# EAGLE design TSOC_NEOLED (EAGLE 6.6.0)
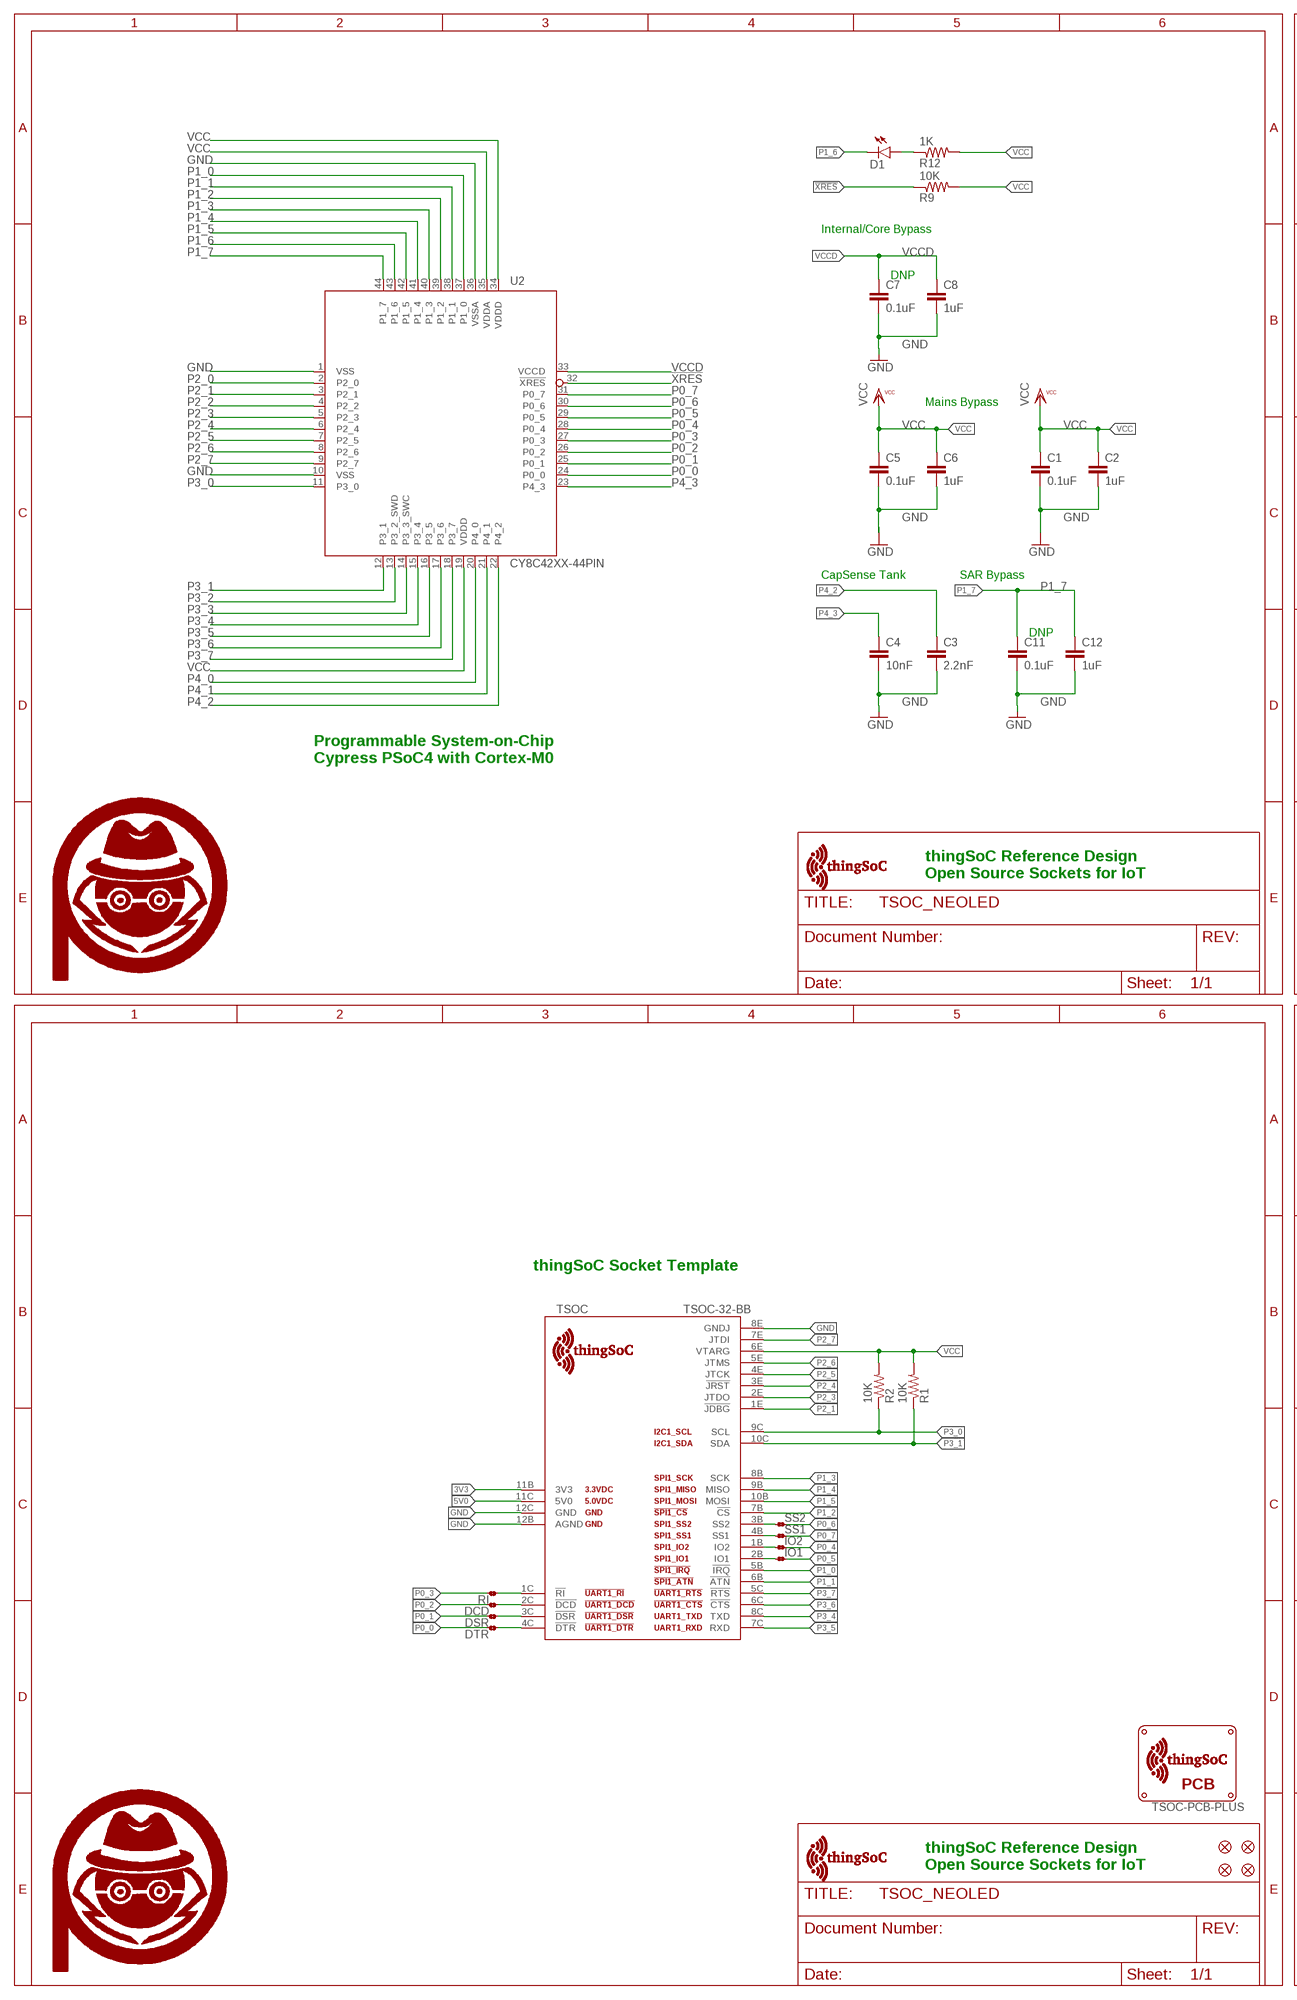
[diagram p0: schematic, sheet 1, part 1 of 2]
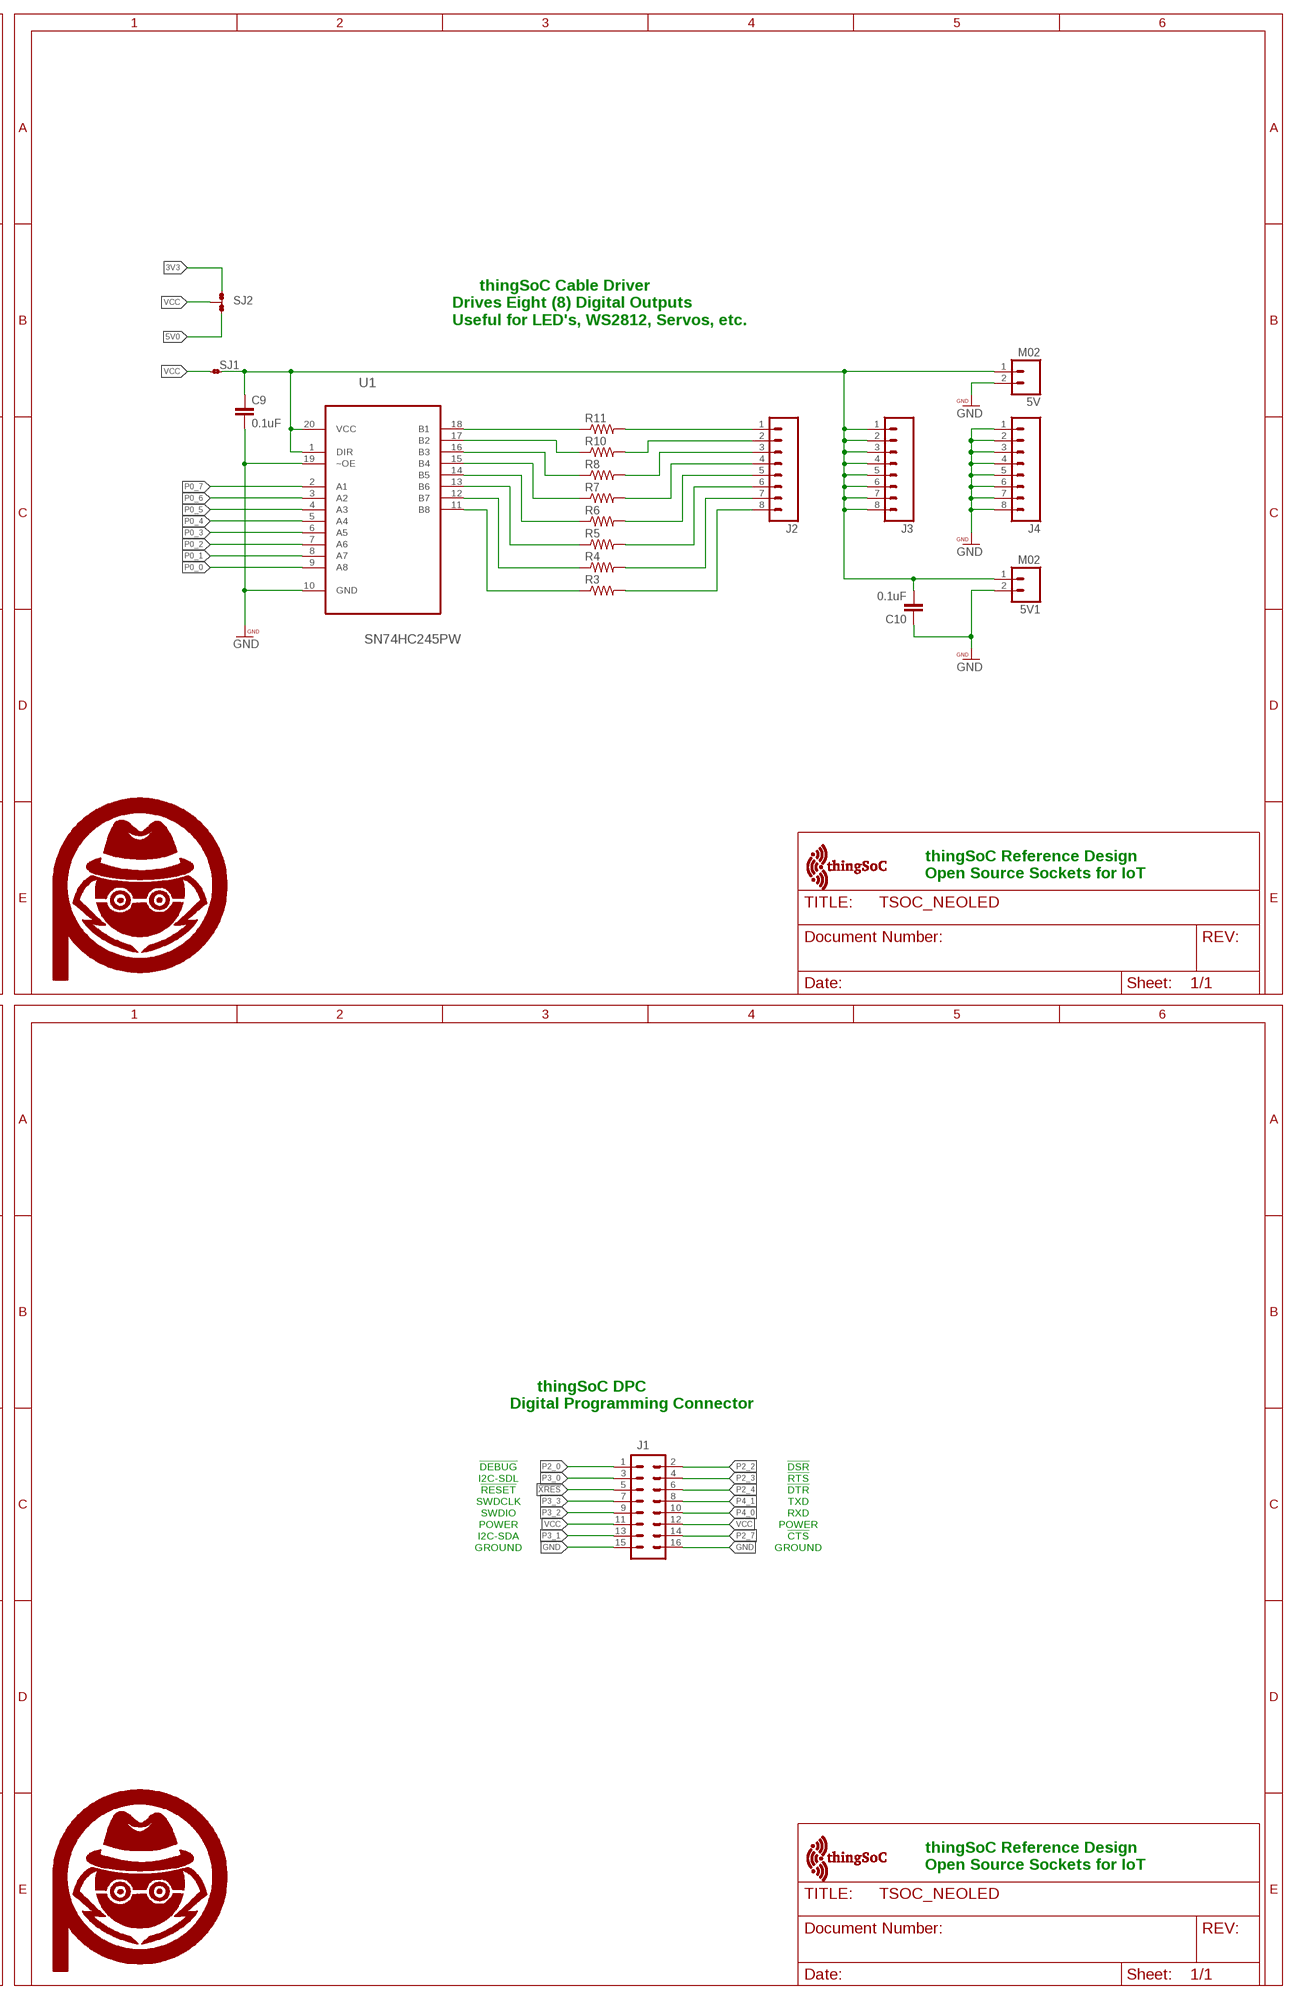
[diagram p1: schematic, sheet 1, part 2 of 2]

## Parts
5V  M02  [1X02]
5V1  M02  [1X02]
$$U$1  TSOC-LOGO-SMALL  [TSOC-LOGO-SML]
$$U$2  TSOC-LOGO-MED  [TSOC-LOGO-MED]
C1  0.1uF  CAP0603-CAP  [0603-CAP]
C2  1uF  CAP0603-CAP  [0603-CAP]
C3  2.2nF  CAP0603-CAP  [0603-CAP]
C4  10nF  CAP0603-CAP  [0603-CAP]
C5  0.1uF  CAP0603-CAP  [0603-CAP]
C6  1uF  CAP0603-CAP  [0603-CAP]
C7  0.1uF  CAP0603-CAP  [0603-CAP]
C8  1uF  CAP0603-CAP  [0603-CAP]
C9  0.1uF  CAP0603-CAP  [0603-CAP]
C10  0.1uF  CAP0603-CAP  [0603-CAP]
C11  0.1uF  CAP0603-CAP  [0603-CAP]
C12  1uF  CAP0603-CAP  [0603-CAP]
D1  LED0603  [LED-0603]
DCD  JMP-2-NO  [JMP-2-NO]
DSR  JMP-2-NO  [JMP-2-NO]
DTR  JMP-2-NO  [JMP-2-NO]
FID1  FIDUCIALUFIDUCIAL  [MICRO-FIDUCIAL]
FID2  FIDUCIALUFIDUCIAL  [MICRO-FIDUCIAL]
FID3  FIDUCIALUFIDUCIAL  [MICRO-FIDUCIAL]
FID4  FIDUCIALUFIDUCIAL  [MICRO-FIDUCIAL]
IO1  JMP-2-NO  [JMP-2-NO]
IO2  JMP-2-NO  [JMP-2-NO]
J1  M08X2  [2X8]
J2  M08  [1X08_ROUND]
J3  M08  [1X08_ROUND]
J4  M08  [1X08_ROUND]
R1  10K  RESISTOR_SFE0603-RES  [0603-RES]
R2  10K  RESISTOR_SFE0603-RES  [0603-RES]
R3  RESISTOR0603-RES  [0603-RES]
R4  RESISTOR0603-RES  [0603-RES]
R5  RESISTOR0603-RES  [0603-RES]
R6  RESISTOR0603-RES  [0603-RES]
R7  RESISTOR0603-RES  [0603-RES]
R8  RESISTOR0603-RES  [0603-RES]
R9  10K  RESISTOR_SFE0603-RES  [0603-RES]
R10  RESISTOR0603-RES  [0603-RES]
R11  RESISTOR0603-RES  [0603-RES]
R12  1K  RESISTOR_SFE0603-RES  [0603-RES]
RI  JMP-2-NO  [JMP-2-NO]
SJ1  JMP-2-NC  [JMP-2-NC]
SJ2  JMP-3-NC  [JMP-3-NC]
SS1  JMP-2-NO  [JMP-2-NO]
SS2  JMP-2-NO  [JMP-2-NO]
TSOC  TSOC-32-BB  [TSOC-BB-S32]
U1  SN74HC245PW  [SOP65P640X120-20N]
U2  CY8C42XX-44PIN  [TQFP-10X10-44]
U$1  TSOC-PCB-PLUS  [TSOC-BB-BRD-PLUS]
U$3  PA_LOGO_SYMNULL  [NULL_SYM]
U$9  PA_LOGO_SYMNULL  [NULL_SYM]
U$10  PA_LOGO_SYMNULL  [NULL_SYM]
U$11  PA_LOGO_SYMNULL  [NULL_SYM]
U$100  TSOC-LOGO-SMALL  [TSOC-LOGO-SML]
U$101  TSOC-LOGO-LRG  [TSOC-LOGO-LRG]

## Nets
3V3: SJ2.1 TSOC.11B(3V3)
5V0: SJ2.3 TSOC.11C(5V0)
!DCD: DCD.1 TSOC.2C(!DCD)
!DSR: DSR.1 TSOC.3C(!DSR)
!DTR: DTR.1 TSOC.4C(!DTR)
!R!: RI.1 TSOC.1C(!RI)
!XRES: J1.5 R9.1 U2.32(!XRES)
GND: 5V1.2 5V.2 C1.2 C2.2 C3.2 C4.2 C5.2 C6.2 C7.2 C8.2 C9.2 C10.1 C11.2 C12.2 J1.15 J1.16 J4.1 J4.2 J4.3 J4.4 J4.5 J4.6 J4.7 J4.8 TSOC.8E(GNDJ) TSOC.12B(AGND) TSOC.12C(GND) U1.10(GND) U1.19(~OE) U2.1(VSS) U2.10(VSS) U2.36(VSSA)
IO1: IO1.1 TSOC.2B(IO1)
IO2: IO2.1 TSOC.1B(IO2)
N$1: J2.1 R11.2
N$2: J2.2 R10.2
N$3: J2.3 R8.2
N$4: J2.4 R7.2
N$5: J2.5 R6.2
N$6: J2.6 R5.2
N$7: J2.7 R4.2
N$8: J2.8 R3.2
N$9: R11.1 U1.18(B1)
N$10: R10.1 U1.17(B2)
N$11: R8.1 U1.16(B3)
N$12: R7.1 U1.15(B4)
N$13: R6.1 U1.14(B5)
N$14: R5.1 U1.13(B6)
N$15: R4.1 U1.12(B7)
N$16: R3.1 U1.11(B8)
N$17: D1.A R12.1
P0_0: DTR.2 U1.9(A8) U2.24(P0_0)
P0_1: DSR.2 U1.8(A7) U2.25(P0_1)
P0_2: DCD.2 U1.7(A6) U2.26(P0_2)
P0_3: RI.2 U1.6(A5) U2.27(P0_3)
P0_4: IO2.2 U1.5(A4) U2.28(P0_4)
P0_5: IO1.2 U1.4(A3) U2.29(P0_5)
P0_6: SS2.2 U1.3(A2) U2.30(P0_6)
P0_7: SS1.2 U1.2(A1) U2.31(P0_7)
P1_0: TSOC.5B(!IRQ) U2.37(P1_0)
P1_1: TSOC.6B(!ATN) U2.38(P1_1)
P1_2: TSOC.7B(!CS) U2.39(P1_2)
P1_3: TSOC.8B(SCK) U2.40(P1_3)
P1_4: TSOC.9B(MISO) U2.41(P1_4)
P1_5: TSOC.10B(MOSI) U2.42(P1_5)
P1_6: D1.C U2.43(P1_6)
P1_7: C11.1 C12.1 U2.44(P1_7)
P2_0: J1.1 U2.2(P2_0)
P2_1: TSOC.1E(!JDBG) U2.3(P2_1)
P2_2: J1.2 U2.4(P2_2)
P2_3: J1.4 TSOC.2E(JTDO) U2.5(P2_3)
P2_4: J1.6 TSOC.3E(!JRST) U2.6(P2_4)
P2_5: TSOC.4E(JTCK) U2.7(P2_5)
P2_6: TSOC.5E(JTMS) U2.8(P2_6)
P2_7: J1.14 TSOC.7E(JTDI) U2.9(P2_7)
P3_0: J1.3 R2.1 TSOC.9C(SCL) U2.11(P3_0)
P3_1: J1.13 R1.1 TSOC.10C(SDA) U2.12(P3_1)
P3_2: J1.9 U2.13(P3_2_SWD)
P3_3: J1.7 U2.14(P3_3_SWC)
P3_4: TSOC.8C(TXD) U2.15(P3_4)
P3_5: TSOC.7C(RXD) U2.16(P3_5)
P3_6: TSOC.6C(!CTS) U2.17(P3_6)
P3_7: TSOC.5C(!RTS) U2.18(P3_7)
P4_0: J1.10 U2.20(P4_0)
P4_1: J1.8 U2.21(P4_1)
P4_2: C3.1 U2.22(P4_2)
P4_3: C4.1 U2.23(P4_3)
SS1: SS1.1 TSOC.4B(SS1)
SS2: SS2.1 TSOC.3B(SS2)
VCC: C1.1 C2.1 C5.1 C6.1 J1.11 J1.12 R1.2 R2.2 R9.2 R12.2 SJ1.1 SJ2.2 TSOC.6E(VTARG) U2.19(VDDD) U2.34(VDDD) U2.35(VDDA)
VCCD: C7.1 C8.1 U2.33(VCCD)
VEXT: 5V1.1 5V.1 C9.1 C10.2 J3.1 J3.2 J3.3 J3.4 J3.5 J3.6 J3.7 J3.8 SJ1.2 U1.1(DIR) U1.20(VCC)

## Notes on the sheet
- Internal/Core Bypass
- DNP
- thingSoC Cable Driver
  Drives Eight (8) Digital Outputs
  Useful for LED's, WS2812, Servos, etc.
- Mains Bypass
- CapSense Tank | SAR Bypass
- DNP
- Programmable System-on-Chip
  Cypress PSoC4 with Cortex-M0
- thingSoC Reference Design
  Open Source Sockets for IoT
- thingSoC Reference Design
  Open Source Sockets for IoT
- thingSoC Socket Template
- thingSoC DPC
  Digital Programming Connector
- !DEBUG | !DSR
- I2C-SDL | !RTS
- !RESET | !DTR
- SWDCLK | TXD
- SWDIO | RXD
- POWER | POWER
- I2C-SDA | !CTS
- GROUND | GROUND
- thingSoC Reference Design
  Open Source Sockets for IoT
- thingSoC Reference Design
  Open Source Sockets for IoT

## Library data of the parts
5V 5V1 = PatternAgents-ProtoPads:M02
$$U$1 $$U$2 U$100 U$101 = thingSoC:TSOC-LOGO: thingSoC Logo Source LBR : http://www.thingsoc.com Github : https://github.com/thingsoc License : http://creativecommons.org/licenses/by-sa/4.0/ (Creative Commons 4.0) THIS SOFTWARE IS PROVIDED BY THE CONTRIBUTORS "AS IS" AND WITHOUT ANY EXPRESS OR IMPLIED WARRANTIES, INCLUDING, BUT NOT LIMITED TO, THE IMPLIED WARRANTIES OF MERCHANTABILITY AND FITNESS FOR A PARTICULAR PURPOSE ARE DISCLAIMED. IN NO EVENT SHALL THE COPYRIGHT OWNER OR CONTRIBUTORS BE LIABLE FOR ANY DIRECT, INDIRECT, INCIDENTAL, SPECIAL, EXEMPLARY, OR CONSEQUENTIAL DAMAGES (INCLUDING, BUT NOT LIMITED TO, PROCUREMENT OF SUBSTITUTE GOODS OR SERVICES; LOSS OF USE, DATA, OR PROFITS; OR BUSINESS INTERRUPTION) HOWEVER CAUSED AND ON ANY THEORY OF LIABILITY, WHETHER IN CONTRACT, STRICT LIABILITY, OR TORT (INCLUDING NEGLIGENCE OR OTHERWISE) ARISING IN ANY WAY OUT OF THE USE OF THIS SOFTWARE, EVEN IF ADVISED OF THE POSSIBILITY OF SUCH DAMAGE.
C1-C12 = PatternAgents-Misc:CAP: Capacitor Standard 0603 ceramic capacitor, and 0.1" leaded capacitor.
D1 = TSOC-ESP8266-BASE:LED: LEDs Standard schematic elements and footprints for 5mm, 3mm, 1206, and 0603 sized LEDs. 5mm - Spark Fun Electronics SKU : COM-00529 (and others)
DCD DSR DTR IO1 IO2 RI SS1 SS2 = PatternAgents-ProtoPads:JMP-2-NO: Two Terminal Jumper - Normally Open Positions 1 and 2 are normally NOT connected. PatternAgents ProtoPads Library Schematic and PCB layout libraries for design patterns by PatternAgents. For the CADSoft Eagle CAD program : http://www.cadsoftusa.com/download-eagle/ Source LBR : http://www.patternagents.com Github : https://github.com/PatternAgents License : http://creativecommons.org/licenses/by-sa/4.0/ (Creative Commons 4.0) THIS SOFTWARE IS PROVIDED BY THE CONTRIBUTORS "AS IS" AND WITHOUT ANY EXPRESS OR IMPLIED WARRANTIES, INCLUDING, BUT NOT LIMITED TO, THE IMPLIED WARRANTIES OF MERCHANTABILITY AND FITNESS FOR A PARTICULAR PURPOSE ARE DISCLAIMED. IN NO EVENT SHALL THE COPYRIGHT OWNER OR CONTRIBUTORS BE LIABLE FOR ANY DIRECT, INDIRECT, INCIDENTAL, SPECIAL, EXEMPLARY, OR CONSEQUENTIAL DAMAGES (INCLUDING, BUT NOT LIMITED TO, PROCUREMENT OF SUBSTITUTE GOODS OR SERVICES; LOSS OF USE, DATA, OR PROFITS; OR BUSINESS INTERRUPTION) HOWEVER CAUSED AND ON ANY THEORY OF LIABILITY, WHETHER IN CONTRACT, STRICT LIABILITY, OR TORT (INCLUDING NEGLIGENCE OR OTHERWISE) ARISING IN ANY WAY OUT OF THE USE OF THIS SOFTWARE, EVEN IF ADVISED OF THE POSSIBILITY OF SUCH DAMAGE.; BOM: EXCLUDE
FID1-FID4 = TSOC-ESP8266-BASE:FIDUCIAL: Fiducial Alignment Points Various fiducial points for machine vision alignment.
J1 = PatternAgents-ProtoPads:M08X2: .1" headers, two rows of 8 each
J2-J4 = PatternAgents-ProtoPads:M08: Header 8 Standard 8-pin 0.1" header
R1 R2 R9 R12 = PatternAgents-Misc:RESISTOR_SFE: Resistor Basic schematic elements and footprints for 0603, 1206, and PTH resistors.
R3-R8 R10 R11 = PatternAgents-ProtoPads:RESISTOR: Resistor Basic schematic elements and footprints for 0603, 1206, and PTH resistors.
SJ1 = PatternAgents-ProtoPads:JMP-2-NC: Two Terminal Jumper - Normally Closed Positions 1 and 2 are normally connected. PatternAgents ProtoPads Library Schematic and PCB layout libraries for design patterns by PatternAgents. For the CADSoft Eagle CAD program : http://www.cadsoftusa.com/download-eagle/ Source LBR : http://www.patternagents.com Github : https://github.com/PatternAgents License : http://creativecommons.org/licenses/by-sa/4.0/ (Creative Commons 4.0) THIS SOFTWARE IS PROVIDED BY THE CONTRIBUTORS "AS IS" AND WITHOUT ANY EXPRESS OR IMPLIED WARRANTIES, INCLUDING, BUT NOT LIMITED TO, THE IMPLIED WARRANTIES OF MERCHANTABILITY AND FITNESS FOR A PARTICULAR PURPOSE ARE DISCLAIMED. IN NO EVENT SHALL THE COPYRIGHT OWNER OR CONTRIBUTORS BE LIABLE FOR ANY DIRECT, INDIRECT, INCIDENTAL, SPECIAL, EXEMPLARY, OR CONSEQUENTIAL DAMAGES (INCLUDING, BUT NOT LIMITED TO, PROCUREMENT OF SUBSTITUTE GOODS OR SERVICES; LOSS OF USE, DATA, OR PROFITS; OR BUSINESS INTERRUPTION) HOWEVER CAUSED AND ON ANY THEORY OF LIABILITY, WHETHER IN CONTRACT, STRICT LIABILITY, OR TORT (INCLUDING NEGLIGENCE OR OTHERWISE) ARISING IN ANY WAY OUT OF THE USE OF THIS SOFTWARE, EVEN IF ADVISED OF THE POSSIBILITY OF SUCH DAMAGE.; BOM: EXCLUDE
SJ2 = PatternAgents-ProtoPads:JMP-3-NC: Three Terminal Jumper - ALL Connected Positions 1, 2, and 3 are normally connected. PatternAgents ProtoPads Library Schematic and PCB layout libraries for design patterns by PatternAgents. For the CADSoft Eagle CAD program : http://www.cadsoftusa.com/download-eagle/ Source LBR : http://www.patternagents.com Github : https://github.com/PatternAgents License : http://creativecommons.org/licenses/by-sa/4.0/ (Creative Commons 4.0) THIS SOFTWARE IS PROVIDED BY THE CONTRIBUTORS "AS IS" AND WITHOUT ANY EXPRESS OR IMPLIED WARRANTIES, INCLUDING, BUT NOT LIMITED TO, THE IMPLIED WARRANTIES OF MERCHANTABILITY AND FITNESS FOR A PARTICULAR PURPOSE ARE DISCLAIMED. IN NO EVENT SHALL THE COPYRIGHT OWNER OR CONTRIBUTORS BE LIABLE FOR ANY DIRECT, INDIRECT, INCIDENTAL, SPECIAL, EXEMPLARY, OR CONSEQUENTIAL DAMAGES (INCLUDING, BUT NOT LIMITED TO, PROCUREMENT OF SUBSTITUTE GOODS OR SERVICES; LOSS OF USE, DATA, OR PROFITS; OR BUSINESS INTERRUPTION) HOWEVER CAUSED AND ON ANY THEORY OF LIABILITY, WHETHER IN CONTRACT, STRICT LIABILITY, OR TORT (INCLUDING NEGLIGENCE OR OTHERWISE) ARISING IN ANY WAY OUT OF THE USE OF THIS SOFTWARE, EVEN IF ADVISED OF THE POSSIBILITY OF SUCH DAMAGE.; BOM: EXCLUDE
TSOC = thingSoC:TSOC-32: thingSoC Thirty-Two (32) Pin Socket Source LBR : http://www.thingsoc.com Github : https://github.com/thingsoc License : http://creativecommons.org/licenses/by-sa/4.0/ (Creative Commons 4.0) THIS SOFTWARE IS PROVIDED BY THE CONTRIBUTORS "AS IS" AND WITHOUT ANY EXPRESS OR IMPLIED WARRANTIES, INCLUDING, BUT NOT LIMITED TO, THE IMPLIED WARRANTIES OF MERCHANTABILITY AND FITNESS FOR A PARTICULAR PURPOSE ARE DISCLAIMED. IN NO EVENT SHALL THE COPYRIGHT OWNER OR CONTRIBUTORS BE LIABLE FOR ANY DIRECT, INDIRECT, INCIDENTAL, SPECIAL, EXEMPLARY, OR CONSEQUENTIAL DAMAGES (INCLUDING, BUT NOT LIMITED TO, PROCUREMENT OF SUBSTITUTE GOODS OR SERVICES; LOSS OF USE, DATA, OR PROFITS; OR BUSINESS INTERRUPTION) HOWEVER CAUSED AND ON ANY THEORY OF LIABILITY, WHETHER IN CONTRACT, STRICT LIABILITY, OR TORT (INCLUDING NEGLIGENCE OR OTHERWISE) ARISING IN ANY WAY OUT OF THE USE OF THIS SOFTWARE, EVEN IF ADVISED OF THE POSSIBILITY OF SUCH DAMAGE.
U1 = PatternAgents-TI:SN74HC245PW: OCTAL BUS TRANSCEIVERS; MPN: SN74HC245PW; OC_FARNELL: 1236221; OC_NEWARK: 13M5213; PACKAGE: TSSOP-20; SUPPLIER: Texas Instruments
U2 = PatternAgents-Cypress:CY8C42XX-44PIN: Cypress PSoC® 4 - Programmable System on Chip, Cortex-M0 Based http://www.cypress.com/?mpn=CY8C4245AXI-483 LBR Source: http://www.patternagents.com THIS SOFTWARE IS PROVIDED BY THE CONTRIBUTORS "AS IS" AND WITHOUT ANY EXPRESS OR IMPLIED WARRANTIES, INCLUDING, BUT NOT LIMITED TO, THE IMPLIED WARRANTIES OF MERCHANTABILITY AND FITNESS FOR A PARTICULAR PURPOSE ARE DISCLAIMED. IN NO EVENT SHALL THE COPYRIGHT OWNER OR CONTRIBUTORS BE LIABLE FOR ANY DIRECT, INDIRECT, INCIDENTAL, SPECIAL, EXEMPLARY, OR CONSEQUENTIAL DAMAGES (INCLUDING, BUT NOT LIMITED TO, PROCUREMENT OF SUBSTITUTE GOODS OR SERVICES; LOSS OF USE, DATA, OR PROFITS; OR BUSINESS INTERRUPTION) HOWEVER CAUSED AND ON ANY THEORY OF LIABILITY, WHETHER IN CONTRACT, STRICT LIABILITY, OR TORT (INCLUDING NEGLIGENCE OR OTHERWISE) ARISING IN ANY WAY OUT OF THE USE OF THIS SOFTWARE, EVEN IF ADVISED OF THE POSSIBILITY OF SUCH DAMAGE.
U$1 = thingSoC:TSOC-PCB: thingSoC PCB Outlines Boards Outlines for Standard Sizes (in the DImension Layer) (Registration marks in the tDocu layer - make sure to turn on tDocu/bDocu) Source LBR : http://www.thingsoc.com Github : https://github.com/thingsoc License : http://creativecommons.org/licenses/by-sa/4.0/ (Creative Commons 4.0) THIS SOFTWARE IS PROVIDED BY THE CONTRIBUTORS "AS IS" AND WITHOUT ANY EXPRESS OR IMPLIED WARRANTIES, INCLUDING, BUT NOT LIMITED TO, THE IMPLIED WARRANTIES OF MERCHANTABILITY AND FITNESS FOR A PARTICULAR PURPOSE ARE DISCLAIMED. IN NO EVENT SHALL THE COPYRIGHT OWNER OR CONTRIBUTORS BE LIABLE FOR ANY DIRECT, INDIRECT, INCIDENTAL, SPECIAL, EXEMPLARY, OR CONSEQUENTIAL DAMAGES (INCLUDING, BUT NOT LIMITED TO, PROCUREMENT OF SUBSTITUTE GOODS OR SERVICES; LOSS OF USE, DATA, OR PROFITS; OR BUSINESS INTERRUPTION) HOWEVER CAUSED AND ON ANY THEORY OF LIABILITY, WHETHER IN CONTRACT, STRICT LIABILITY, OR TORT (INCLUDING NEGLIGENCE OR OTHERWISE) ARISING IN ANY WAY OUT OF THE USE OF THIS SOFTWARE, EVEN IF ADVISED OF THE POSSIBILITY OF SUCH DAMAGE.
U$3 U$9-U$11 = PatternAgents-Logos:PA_LOGO_SYM: PatternAgents Logo Symbol Trademark : PatternAgents, LLC Github : https://github.com/PatternAgents/PCB_Libraries License : http://creativecommons.org/licenses/by-sa/3.0/ (Creative Commons 3.0) THIS SOFTWARE IS PROVIDED BY THE CONTRIBUTORS "AS IS" AND WITHOUT ANY EXPRESS OR IMPLIED WARRANTIES, INCLUDING, BUT NOT LIMITED TO, THE IMPLIED WARRANTIES OF MERCHANTABILITY AND FITNESS FOR A PARTICULAR PURPOSE ARE DISCLAIMED. IN NO EVENT SHALL THE COPYRIGHT OWNER OR CONTRIBUTORS BE LIABLE FOR ANY DIRECT, INDIRECT, INCIDENTAL, SPECIAL, EXEMPLARY, OR CONSEQUENTIAL DAMAGES (INCLUDING, BUT NOT LIMITED TO, PROCUREMENT OF SUBSTITUTE GOODS OR SERVICES; LOSS OF USE, DATA, OR PROFITS; OR BUSINESS INTERRUPTION) HOWEVER CAUSED AND ON ANY THEORY OF LIABILITY, WHETHER IN CONTRACT, STRICT LIABILITY, OR TORT (INCLUDING NEGLIGENCE OR OTHERWISE) ARISING IN ANY WAY OUT OF THE USE OF THIS SOFTWARE, EVEN IF ADVISED OF THE POSSIBILITY OF SUCH DAMAGE.

## Board
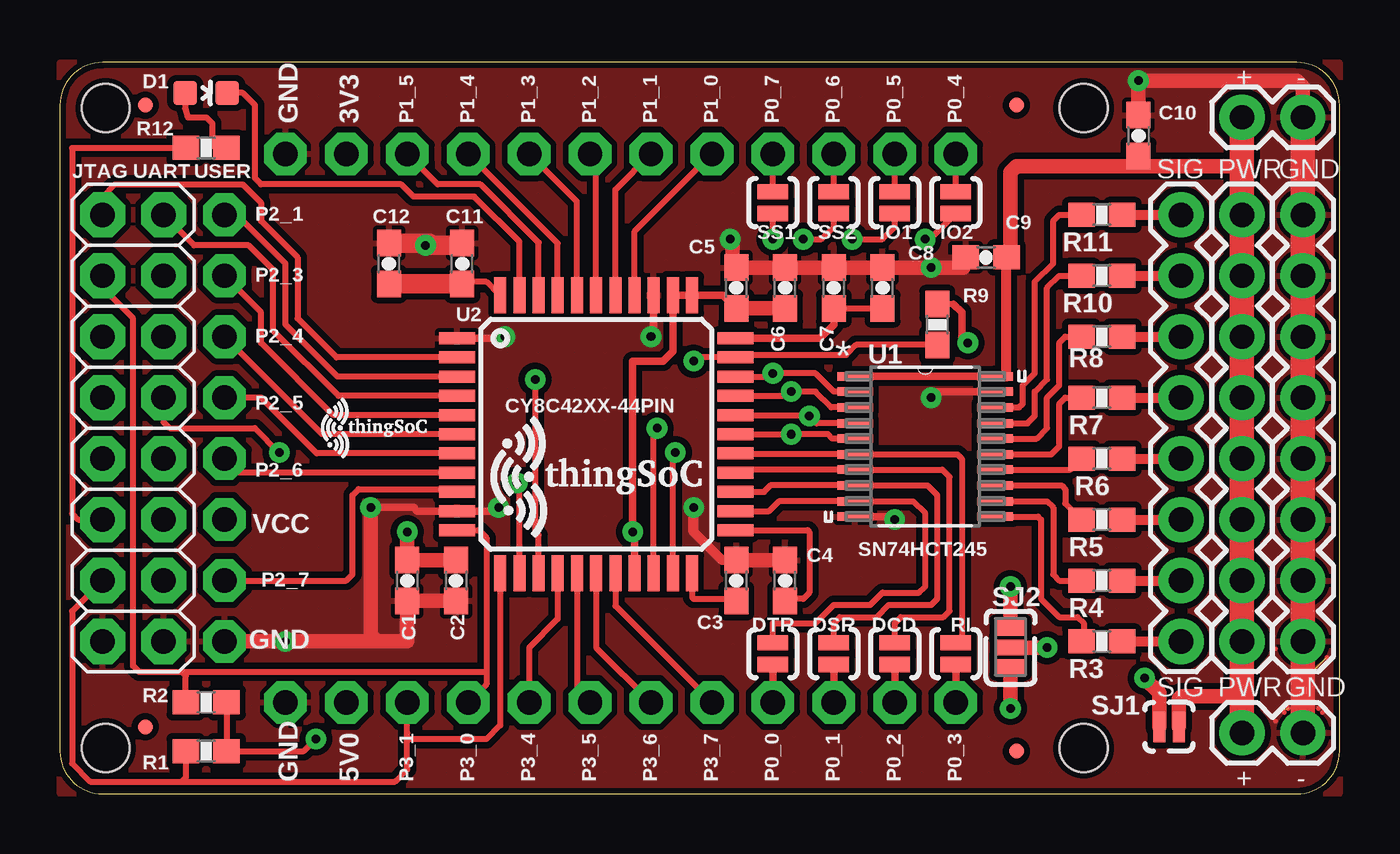
[diagram p2: board, top side]
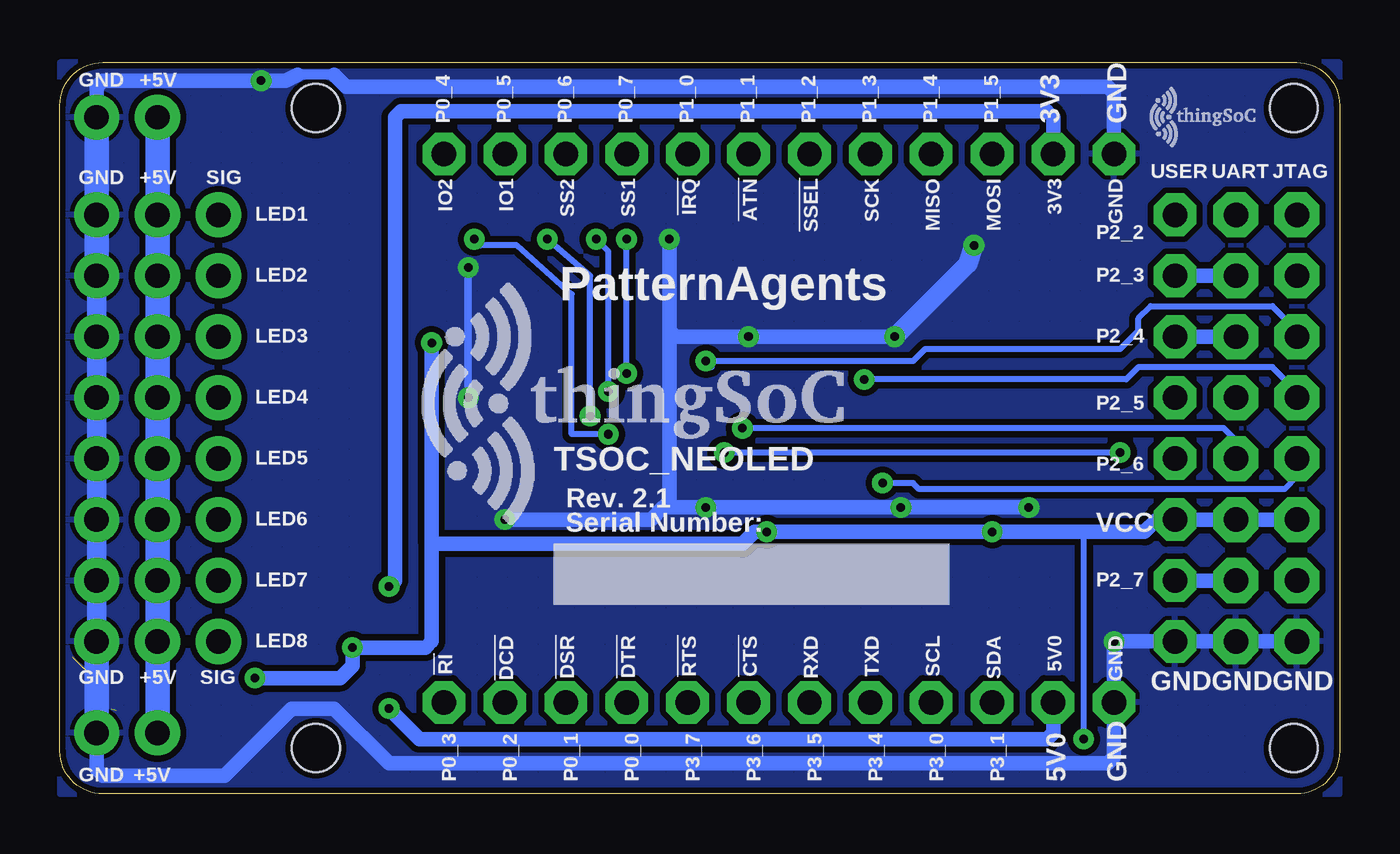
[diagram p3: board, bottom side, seen from below]

Size 53.34 x 30.48 mm. Coordinates in mm from the lower left corner, seen from the top.
Copper layers (1*16): Top 0.035mm / dielectric 1.5mm / Bottom 0.035mm
Design rules "PatternAgents_7mil": minimum track width 7mil, minimum drill 14mil, track to track 7mil, track to pad 7mil, pad to pad 7mil, via to via 7mil, smd to smd 7mil, copper to edge 7mil, drill to drill 7mil, minimum pad ring 12mil, minimum via ring 10mil, stop-mask expansion 4mil, vias tented up to drill 25mil, thermal gap 7mil

### Footprints (pad centres in the part's own frame; a part is rotated, then mirrored left to right if it is on the bottom)
1X02 = drill 1.016 pad 1.88: 1 0,0; 2 2.54,0
0603-CAP = smd 1.1 x 1: 1 -0.85,0; 2 0.85,0
LED-0603 = smd 1 x 1: A 0,-0.877; C 0,0.877
JMP-2-NO = smd 0.635 x 1.27: 1 -0.45,0; 2 0.45,0
MICRO-FIDUCIAL = smd 0.635 x 0.635: 1 0,0
2X8 = drill 1.016 pad 1.88 octagon: 1 0,0; 2 0,2.54; 3 2.54,0; 4 2.54,2.54; 5 5.08,0; 6 5.08,2.54; 7 7.62,0; 8 7.62,2.54; 9 10.16,0; 10 10.16,2.54; 11 12.7,0; 12 12.7,2.54; 13 15.24,0; 14 15.24,2.54; 15 17.78,0; 16 17.78,2.54
1X08_ROUND = drill 1.016 pad 1.88: 1 0,0; 2 2.54,0; 3 5.08,0; 4 7.62,0; 5 10.16,0; 6 12.7,0; 7 15.24,0; 8 17.78,0
0603-RES = smd 1.1 x 1: 1 -0.85,0; 2 0.85,0
JMP-2-NC = smd 0.508 x 1.27: 1 -0.401,0; 2 0.413,0
JMP-3-NC = smd 0.635 x 1.27: 1 -0.813,0; 2 0,0; 3 0.813,0
TSOC-BB-S32 = drill 1.016 pad 1.778 octagon: 1B -11.43,-11.43; 1C -11.43,11.43; 1E 19.05,-8.89; 2B -8.89,-11.43; 2C -8.89,11.43; 2E 19.05,-6.35; 3B -6.35,-11.43; 3C -6.35,11.43; 3E 19.05,-3.81; 4B -3.81,-11.43; 4C -3.81,11.43; 4E 19.05,-1.27; 5B -1.27,-11.43; 5C -1.27,11.43; 5E 19.05,1.27; 6B 1.27,-11.43; 6C 1.27,11.43; 6E 19.05,3.81; 7B 3.81,-11.43; 7C 3.81,11.43; 7E 19.05,6.35; 8B 6.35,-11.43; 8C 6.35,11.43; 8E 19.05,8.89; 9B 8.89,-11.43; 9C 8.89,11.43; 10B 11.43,-11.43; 10C 11.43,11.43; 11B 13.97,-11.43; 11C 13.97,11.43; 12B 16.51,-11.43; 12C 16.51,11.43
SOP65P640X120-20N = smd 1.473 x 0.356: 1 -2.921,2.921; 2 -2.921,2.286; 3 -2.921,1.626; 4 -2.921,0.965; 5 -2.921,0.33; 6 -2.921,-0.33; 7 -2.921,-0.965; 8 -2.921,-1.626; 9 -2.921,-2.286; 10 -2.921,-2.921; 11 2.921,-2.921; 12 2.921,-2.286; 13 2.921,-1.626; 14 2.921,-0.965; 15 2.921,-0.33; 16 2.921,0.33; 17 2.921,0.965; 18 2.921,1.626; 19 2.921,2.286; 20 2.921,2.921
TQFP-10X10-44 = smd 1.5 x 0.5: 1 -5.8,4; 2 -5.8,3.2; 3 -5.8,2.4; 4 -5.8,1.6; 5 -5.8,0.8; 6 -5.8,0; 7 -5.8,-0.8; 8 -5.8,-1.6; 9 -5.8,-2.4; 10 -5.8,-3.2; 11 -5.8,-4; 23 5.8,-4; 24 5.8,-3.2; 25 5.8,-2.4; 26 5.8,-1.6; 27 5.8,-0.8; 28 5.8,0; 29 5.8,0.8; 30 5.8,1.6; 31 5.8,2.4; 32 5.8,3.2; 33 5.8,4 | smd 0.5 x 1.5: 12 -4,-5.8; 13 -3.2,-5.8; 14 -2.4,-5.8; 15 -1.6,-5.8; 16 -0.8,-5.8; 17 0,-5.8; 18 0.8,-5.8; 19 1.6,-5.8; 20 2.4,-5.8; 21 3.2,-5.8; 22 4,-5.8; 34 4,5.8; 35 3.2,5.8; 36 2.4,5.8; 37 1.6,5.8; 38 0.8,5.8; 39 0,5.8; 40 -0.8,5.8; 41 -1.6,5.8; 42 -2.4,5.8; 43 -3.2,5.8; 44 -4,5.8
TSOC-BB-BRD-PLUS = hole 2: 1.905,1.905; 28.575,1.905; 1.905,42.672; 28.575,42.672

### Placement (x,y rotation side)
5V  49.28,28.19 0 top
5V1  49.28,2.54 0 top
$$U$1  11.68,15.24 0 top
$$U$2  19.56,13.21 0 top
C1  14.48,8.89 270 top
C2  16.51,8.89 270 top
C3  28.19,8.89 90 top
C4  30.23,8.89 90 top
C5  28.19,21.08 90 top
C6  30.23,21.08 90 top
C7  32.26,21.08 90 top
C8  34.29,21.08 90 top
C9  38.61,22.35 180 top
C10  44.96,27.43 270 top
C11  16.76,22.1 90 top
C12  13.72,22.1 90 top
D1  6.1,29.21 270 top
DCD  34.8,5.84 90 top
DSR  32.26,5.84 90 top
DTR  29.72,5.84 90 top
FID1  3.56,28.7 0 top
FID2  3.56,2.79 0 top
FID3  39.88,1.78 0 top
FID4  39.88,28.7 0 top
IO1  34.8,24.64 270 top
IO2  37.34,24.64 270 top
J1  1.78,24.13 270 top
J2  46.74,24.13 270 top
J3  49.28,24.13 270 top
J4  51.82,24.13 270 top
R1  6.1,1.78 0 top
R2  6.1,3.81 0 top
R3  43.43,6.35 0 top
R4  43.43,8.89 0 top
R5  43.43,11.43 0 top
R6  43.43,13.97 0 top
R7  43.43,16.51 0 top
R8  43.43,19.05 0 top
R9  36.58,19.56 90 top
R10  43.43,21.59 0 top
R11  43.43,24.13 0 top
R12  6.1,26.92 180 top
RI  37.34,5.84 90 top
SJ1  46.23,2.79 0 top
SJ2  39.62,6.1 270 top
SS1  29.72,24.64 270 top
SS2  32.26,24.64 270 top
TSOC  25.91,15.24 180 top
U1  36.07,14.48 0 top
U2  22.35,14.99 0 top
U$1  0,30.48 270 top
U$3  0,0 0 top
U$9  0,0 0 top
U$10  0,0 0 top
U$11  0,0 0 top
U$100  7.11,28.19 0 bottom
U$101  35.05,16.26 0 bottom

### Tracks (layer width: path | path; a pad name or v marks a point on that pad's centre or on a via)
3V3  (via drill 0.36)
  Top 0.61: SJ2.1 v39.62,8.64
  Bottom 0.61: TSOC.11B 11.94,28.19 12.19,28.45 39.12,28.45 39.37,28.19 39.37,8.89 v39.62,8.64
5V0  (via drill 0.36)
  Top 0.61: SJ2.3 v39.62,3.56
  Bottom 0.61: TSOC.11C 11.94,2.54 12.19,2.29 38.35,2.29 v39.62,3.56
!DCD
  Top 0.305: DCD.1 TSOC.2C
!DSR
  Top 0.305: DSR.1 TSOC.3C
!DTR
  Top 0.305: DTR.1 TSOC.4C
!R!
  Top 0.305: RI.1 TSOC.1C
!XRES  (via drill 0.36)
  Top 0.254: v26.42,18.03 26.57,18.19 U2.32 28.25,18.29 32.77,18.29 33.19,18.71 R9.1
  Bottom 0.254: 26.16,17.78 v26.42,18.03 17.78,18.03 17.27,18.54 9.14,18.54 8.38,19.3 8.38,19.81 7.87,20.32 2.79,20.32 1.78,19.3 J1.5
GND  (via drill 0.36)  (2 unrouted)
  Top 0.178: 52.27,5.16 52.09,5.16 | 52.09,5.16 51.82,5.16 | 51.74,3.38 5V1.2 | 50.67,6.04 50.59,6.08 | 52.63,3.38 52.68,3.43 | 52.45,3.56 52.48,3.6 | 52.09,5.16 52.1,5.13 | 50.67,3.02 50.67,3.03 | 51.56,5.16 51.52,5.14 | 51.92,3.38 5V1.2 | 51.92,6.22 J4.8 | 51.92,6.22 | 51.92,5.69 J4.8 | J4.8 51.74,6.22 51.69,6.22 | 51.74,5.87 J4.8 | 51.74,3.2 5V1.2 | 51.74,3.02 5V1.2 | 51.74,2.67 5V1.2 | 51.74,2.67 | 51.21,3.56 51.18,3.61 | 51.03,3.38 51.01,3.49 | 52.81,5.69 52.85,5.66
  Top 0.254: 15.41,22.95 v15.24,22.86 | 16.68,22.86 C11.2
  Top 0.305: v18.29,11.94 18.19,11.79 U2.10 14.88,11.79 14.73,11.94 v12.95,11.94 | 28.11,21.84 C5.2 28.03,22.1 | U1.10 34.92,11.56 v34.8,11.43 | U2.1 18.48,18.99 v18.54,19.05 | U2.36 24.75,19.16 v24.64,19.05 | U1.19 36.58,16.76 v36.32,16.51
  Top 0.406: C3.2 27.6,9.74 26.42,10.92 v26.42,11.94
  Top 0.61: 13.21,6.35 14.48,6.35 C1.2 C2.2 | 13.21,6.35 v9.4,6.35 TSOC.8E | v12.95,11.94 12.95,6.6 13.21,6.35 | C5.2 C6.2 C7.2 C8.2 v36.32,21.93 37.67,21.93 C9.2 | 28.03,22.1 28.03,23.03 v27.94,23.11 | C3.2 C4.2 | C10.1 v44.96,29.72 51.56,29.72 51.82,29.46 5V.2
  Top 0.813: C12.2 15.41,22.95 | v15.24,22.86 16.68,22.86
  Top 1.016: 5V.2 J4.8 51.82,5.16 5V1.2
  Bottom 0.305: v36.32,16.51 v36.32,21.93
  Bottom 0.406: 41.91,29.97 43.43,29.97
  Bottom 0.61: 28.19,11.94 v26.42,11.94 v18.29,11.94 v12.95,11.94 | J1.15 J1.16 TSOC.8E v9.4,6.35 TSOC.12C 9.4,1.52 9.65,1.27 39.62,1.27 41.91,3.56 43.69,3.56 46.48,0.76 51.56,0.76 51.82,1.02 5V1.2 | TSOC.12B 9.4,29.21 9.65,29.46 41.4,29.46 41.91,29.97 | v27.94,23.11 27.94,19.3 | 27.94,19.3 27.94,12.19 28.19,11.94 | v34.8,11.43 28.7,11.43 28.19,11.94 | v18.54,19.05 v24.64,19.05 27.69,19.05 27.94,19.3 | 43.43,29.97 43.94,29.72 v44.96,29.72 51.56,29.72 51.82,29.46 5V.2
  Bottom 0.813: J4.2 J4.3 J4.4 J4.5 J4.6 J4.7 J4.8 | v15.24,22.86 15.49,22.1 v18.54,19.05
  Bottom 1.016: J4.8 5V1.2 | J4.2 J4.1 5V.2
  pour Top (isolate 0.254, hatched): 0,0 0,30.48 53.34,30.48 53.34,0
  pour Bottom (isolate 0.254, hatched): 0,0 0,30.48 53.34,30.48 53.34,0
IO1
  Top 0.254: IO1.1 TSOC.2B
IO2
  Top 0.254: IO2.1 TSOC.1B
N$1
  Top 0.406: R11.2 J2.1
N$2
  Top 0.406: R10.2 J2.2
N$3
  Top 0.406: R8.2 J2.3
N$4
  Top 0.406: R7.2 J2.4
N$5
  Top 0.406: R6.2 J2.5
N$6
  Top 0.406: R5.2 J2.6
N$7
  Top 0.406: R4.2 J2.7
N$8
  Top 0.406: R3.2 J2.8
N$9
  Top 0.254: U1.18 39.98,16.1 40.13,16.26 40.13,17.02 40.64,17.53 40.64,21.34 41.4,22.1 41.4,23.88 41.66,24.13 R11.1
N$10
  Top 0.254: U1.17 40.34,15.44 40.64,15.75 40.64,16.76 41.15,17.27 41.15,21.08 41.66,21.59 R10.1
N$11
  Top 0.254: U1.16 40.72,14.81 41.15,15.24 41.15,16.51 41.66,17.02 41.66,18.8 41.91,19.05 R8.1
N$12
  Top 0.254: U1.15 41.33,14.15 41.66,14.48 41.66,16.26 41.91,16.51 R7.1
N$13
  Top 0.254: U1.14 42.13,13.51 R6.1
N$14
  Top 0.254: U1.13 41.76,12.85 41.91,12.7 41.91,12.1 R5.1
N$15
  Top 0.254: U1.12 41.15,12.19 41.4,11.94 41.4,9.14 41.66,8.89 R4.1
N$16
  Top 0.254: U1.11 40.77,11.56 40.89,11.43 40.89,8.13 41.66,7.37 42.42,7.37 42.67,7.11 42.67,6.44 R3.1
N$17
  Top 0.254: D1.A 5.22,28.56 5.33,28.19 6.1,28.19 6.35,27.94 6.35,27.01 R12.1
P0_0
  Top 0.254: U2.24 29.57,11.79 29.97,12.19 U1.9 35.56,12.19 36.07,11.68 36.07,8.64 35.81,8.38 34.29,8.38 33.78,7.87 32.26,7.87 31.5,7.11 29.72,7.11 DTR.2
P0_1
  Top 0.254: U2.25 29.35,12.59 29.62,12.85 U1.8 36.17,12.85 36.58,12.45 36.58,8.13 36.32,7.87 34.54,7.87 34.04,7.37 32.51,7.37 32.26,7.11 DSR.2
P0_2
  Top 0.254: U2.26 28.28,13.51 U1.7 36.78,13.51 37.08,13.21 37.08,7.62 36.83,7.37 35.05,7.37 34.8,7.11 DCD.2
P0_3
  Top 0.254: U2.27 28.19,14.15 U1.6 37.41,14.15 37.59,13.97 37.59,6.55 RI.2
P0_4  (via drill 0.36)
  Top 0.254: v36.07,23.11 36.26,23.11 IO2.2 | U2.28 v30.48,14.99 32,14.99 32.18,14.81 U1.5
  Bottom 0.254: v30.48,14.99 32,14.99 32,20.83 34.29,22.86 35.81,22.86 v36.07,23.11
P0_5  (via drill 0.36)
  Top 0.254: U2.29 31.03,15.79 v31.24,15.75 31.55,15.44 U1.4 | v33.02,23.11 34.29,23.11 34.8,23.62 IO1.2
  Bottom 0.254: v31.24,15.75 31.24,21.59 v33.02,23.11
P0_6  (via drill 0.36)
  Top 0.254: U2.30 30.3,16.59 v30.48,16.76 31.5,16.76 32.16,16.1 U1.3 | v30.99,23.11 31.75,23.11 32.26,23.62 SS2.2
  Bottom 0.254: v30.48,16.76 30.48,22.61 v30.99,23.11
P0_7  (via drill 0.36)
  Top 0.254: U2.31 29.6,17.39 v29.72,17.53 31.5,17.53 32.26,16.76 U1.2 | v29.72,23.11 SS1.2
  Bottom 0.254: v29.72,17.53 v29.72,23.11
P1_0
  Top 0.254: U2.37 23.95,23.44 TSOC.5B
P1_1
  Top 0.254: U2.38 23.15,25.18 TSOC.6B
P1_2
  Top 0.254: U2.39 22.35,26.42 TSOC.7B
P1_3
  Top 0.254: U2.40 21.55,24.68 TSOC.8B
P1_4
  Top 0.254: U2.41 20.75,22.94 TSOC.9B
P1_5
  Top 0.254: U2.42 19.95,22.97 17.53,25.4 15.75,25.4 TSOC.10B
P1_6
  Top 0.254: D1.C 7.62,29.21 8.13,28.7 8.13,25.65 8.38,25.4 14.22,25.4 14.73,24.89 17.27,24.89 19.15,23.01 U2.43
P1_7
  Top 0.254: U2.44 18.33,20.79 17.78,21.34 16.6,21.34 C11.1
  Top 0.813: C11.1 C12.1
P2_0
  Top 0.254: J1.1 1.78,24.89 2.29,25.4 7.62,25.4 8.38,24.64 8.38,23.88 9.91,22.35 9.91,19.81 11.53,18.19 U2.2
P2_1
  Top 0.254: U2.3 11.57,17.39 9.4,19.56 9.4,22.1 7.37,24.13 TSOC.1E
P2_2
  Top 0.254: U2.4 11.61,16.59 8.89,19.3 8.89,21.84 7.87,22.86 5.59,22.86 J1.2
P2_3
  Top 0.254: U2.5 11.39,15.79 8.38,18.8 8.38,20.07 TSOC.2E
  Bottom 0.61: J1.4 TSOC.2E
P2_4
  Top 0.254: U2.6 10.92,14.99 TSOC.3E
  Bottom 0.61: TSOC.3E J1.6
P2_5
  Top 0.254: U2.7 10.71,14.19 8.38,16.51 TSOC.4E
P2_6
  Top 0.254: U2.8 7.44,13.39 TSOC.5E
P2_7
  Top 0.254: TSOC.7E 11.94,8.89 12.19,9.14 12.19,12.45 12.45,12.7 16.44,12.7 U2.9
  Bottom 0.61: J1.14 TSOC.7E
P3_0
  Top 0.254: U2.11 17.46,10.99 17.78,10.67 17.78,5.08 | 17.78,5.08 17.78,4.57 TSOC.9C | J1.3 1.78,21.08 3.05,19.81 3.05,5.33 3.3,5.08 5.08,5.08 | 5.08,5.08 17.78,5.08 | R2.1 5.25,4.91 5.08,5.08
P3_1
  Top 0.254: U2.12 18.35,2.86 17.78,2.29 14.48,2.29 | 14.48,2.54 TSOC.10C 14.48,2.29 | J1.13 0.51,7.62 0.51,1.27 1.27,0.51 5.08,0.51 | 5.08,0.51 13.97,0.51 14.48,1.02 14.48,2.29 | R1.1 5.25,0.67 5.08,0.51
P3_2  (via drill 0.36)
  Top 0.254: U2.13 19.15,12.85 v19.05,12.95
  Bottom 0.254: J1.9 1.78,13.21 2.29,12.7 17.53,12.7 17.78,12.95 v19.05,12.95
P3_3  (via drill 0.36)
  Top 0.254: v19.81,17.27 19.81,10.92 19.95,10.78 U2.14
  Bottom 0.254: J1.7 1.78,16.76 2.79,17.78 8.38,17.78 8.89,17.27 v19.81,17.27
P3_4
  Top 0.254: U2.15 20.75,7.29 19.56,6.1 TSOC.8C
P3_5
  Top 0.254: U2.16 21.55,4.36 TSOC.7C
P3_6
  Top 0.254: U2.17 22.35,6.1 TSOC.6C
P3_7
  Top 0.254: U2.18 23.15,7.84 TSOC.5C
P4_0  (via drill 0.36)
  Top 0.254: U2.20 24.75,15.1 v24.89,15.24
  Bottom 0.254: J1.10 4.32,14.73 4.83,15.24 v24.89,15.24
P4_1  (via drill 0.36)
  Top 0.254: J1.8 4.32,15.49 4.57,15.24 8.13,15.24 v9.14,14.22 | U2.21 25.55,14.07 v25.65,14.22
  Bottom 0.254: v9.14,14.22 v25.65,14.22
P4_2
  Top 0.254: U2.22 26.35,8.19 26.42,8.13 28.11,8.13 C3.1
P4_3
  Top 0.254: U2.23 31.18,10.99 31.24,10.92 31.24,8.38 30.99,8.13 30.31,8.13 C4.1
SS1
  Top 0.254: SS1.1 TSOC.4B
SS2
  Top 0.254: SS2.1 TSOC.3B
VCC  (via drill 0.36)
  Top 0.254: 27.89,20.53 C5.1 | J1.11 0.76,11.43 0.51,11.68 0.51,26.92 R12.2 | v10.67,2.29 10.16,1.78 R1.2 R2.2 | 37.25,20.41 R9.2
  Top 0.305: U2.19 23.95,10.85 v23.88,10.92 23.88,18.03 25.15,18.03 25.55,18.44 U2.35 U2.34 27.64,20.79 C5.1 | 37.25,20.41 37.59,20.07 37.59,19.05 v37.85,18.8
  Top 0.61: v14.48,10.92 C1.1 C2.1 | C6.1 C5.1 | SJ1.1 45.83,4.21 v45.21,4.83 | v41.15,6.1 SJ2.2
  Bottom 0.254: v10.67,2.29 10.67,10.67 10.41,10.92
  Bottom 0.61: J1.11 J1.12 TSOC.6E 7.62,11.43 8.13,10.92 10.41,10.92 v14.48,10.92 v23.88,10.92 24.38,10.92 24.89,10.41 37.85,10.41 | 37.85,10.41 v37.85,18.8 | v45.21,4.83 41.66,4.83 41.15,5.33 v41.15,6.1 38.1,6.1 37.85,6.35 37.85,10.41
VCCD
  Top 0.254: C7.1 C8.1
  Top 0.305: U2.33 31.69,18.99 32.26,19.56 C7.1
VEXT
  Top 0.305: U1.1 U1.20
  Top 0.406: U1.20 39.46,17.4 C9.1
  Top 0.61: SJ1.2 46.64,3.97 46.74,4.06 49.02,4.06 49.28,3.81 | 49.28,25.91 49.02,26.16 44.96,26.16 | C9.1 39.62,22.26 39.62,25.91 39.88,26.16 44.96,26.16 | C10.2 44.96,26.16
  Top 1.016: 5V.1 49.28,25.91 J3.1 49.28,3.81 5V1.1
  Bottom 1.016: 5V1.1 J3.8 J3.7 J3.6 J3.5 J3.4 J3.3 J3.2 5V.1

### Text on the board
tPlace: + | - | GND | 3V3 | P1_5 | P1_4 | P1_3 | P1_2 | P1_1 | P1_0 | P0_7 | P0_6 | P0_5 | P0_4 | JTAG | UART | USER | SIG | PWR | GND | P2_1 | P2_3 | P2_4 | P2_5 | P2_6 | VCC | SN74HCT245 | P2_7 | GND | SIG | PWR | GND | GND | 5V0 | P3_1 | P3_0 | P3_4 | P3_5 | P3_6 | P3_7 | P0_0 | P0_1 | P0_2 | P0_3 | + | -
bPlace: +5V | GND | GND | 3V3 | P1_5 | P1_4 | P1_3 | P1_2 | P1_1 | P1_0 | P0_7 | P0_6 | P0_5 | P0_4 | JTAG | UART | USER | GND | 3V3 | MOSI | MISO | SCK | !SSEL | !ATN | !IRQ | SS1 | SS2 | IO1 | IO2 | SIG | +5V | GND | LED1 | P2_2 | P2_3 | PatternAgents | LED2 | P2_4 | LED3 | P2_5 | LED4 | LED5 | P2_6 | TSOC_NEOLED | Rev. 2.1 | VCC | Serial Number: | LED6 | P2_7 | LED7 | GND | 5V0 | SDA | SCL | TXD | RXD | !CTS | !RTS | !DTR | !DSR | !DCD | !RI | LED8 | SIG | +5V | GND | GND | GND | GND | GND | 5V0 | P3_1 | P3_0 | P3_4 | P3_5 | P3_6 | P3_7 | P0_0 | P0_1 | P0_2 | P0_3 | +5V | GND